# Altium schematic sheet obc-v2_CM4-IRQ-CTRL.SchDoc
size 420 x 297 mm; SheetNumber: 18; SheetTotal: 23
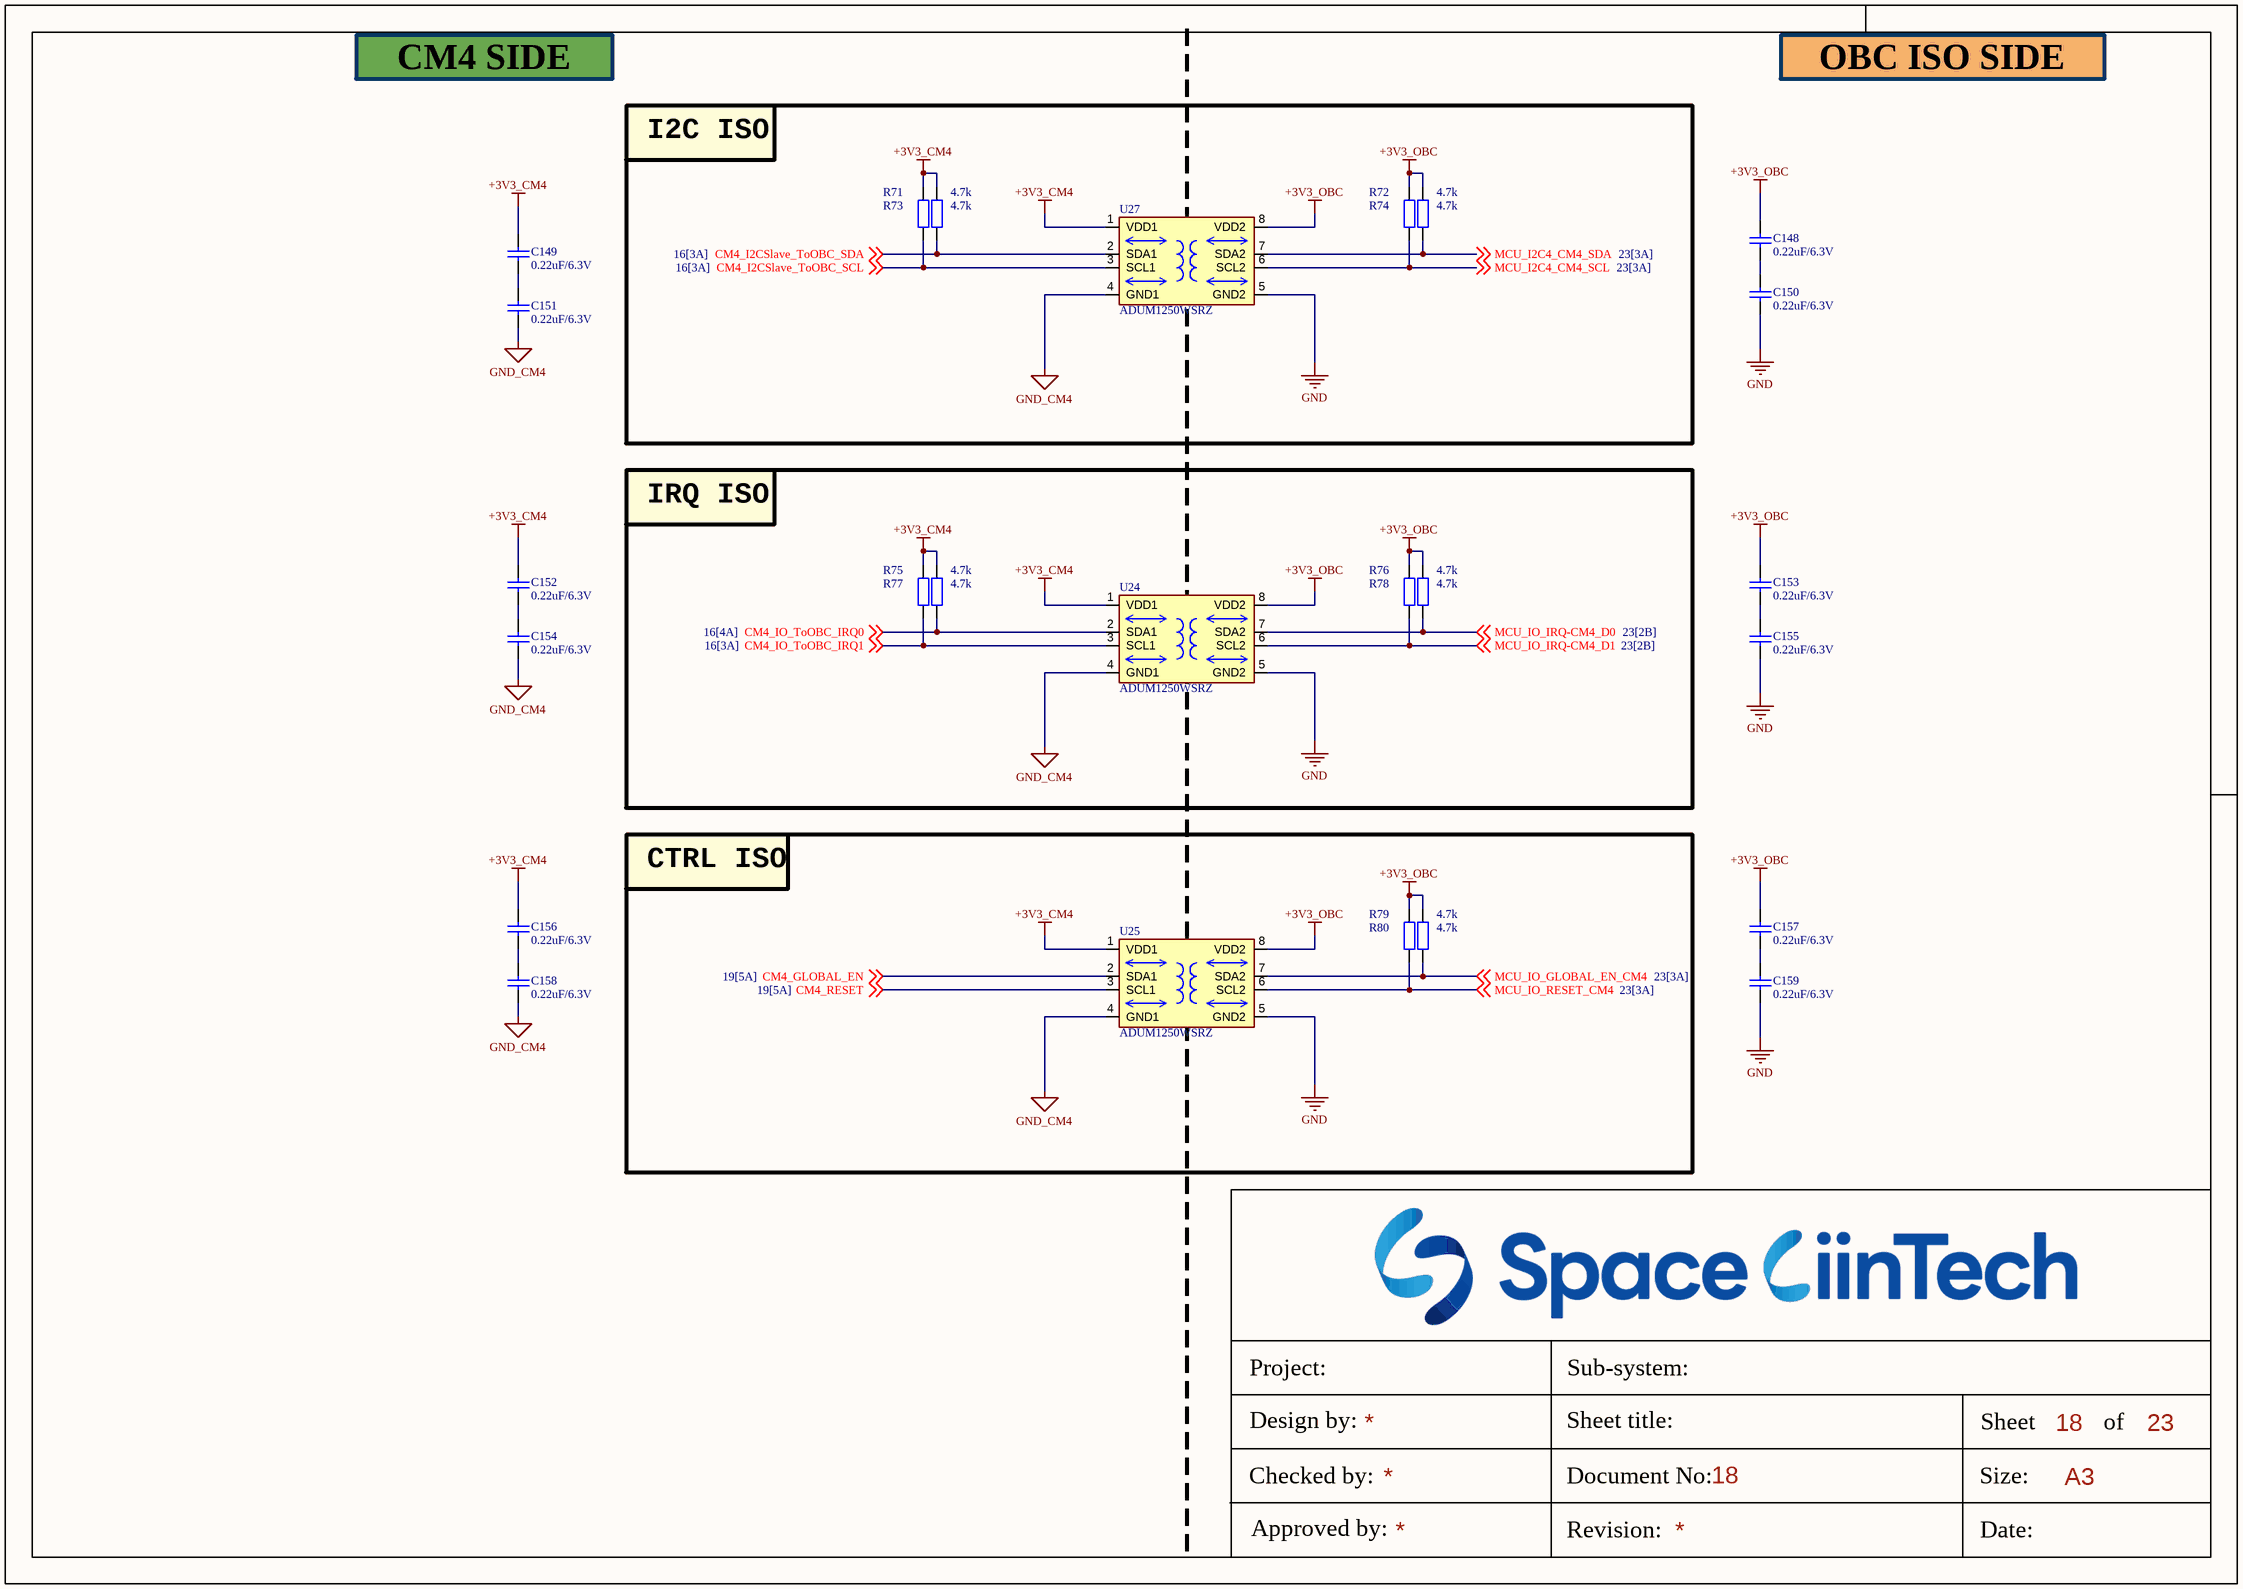
[diagram p0: obc-v2_CM4-IRQ-CTRL.SchDoc]

## Parts
C148  0.22uF/6.3V  [CAP_C_1005X60]
C149  0.22uF/6.3V  [CAP_C_1005X60]
C150  0.22uF/6.3V  [CAP_C_1005X60]
C151  0.22uF/6.3V  [CAP_C_1005X60]
C152  0.22uF/6.3V  [CAP_C_1005X60]
C153  0.22uF/6.3V  [CAP_C_1005X60]
C154  0.22uF/6.3V  [CAP_C_1005X60]
C155  0.22uF/6.3V  [CAP_C_1005X60]
C156  0.22uF/6.3V  [CAP_C_1005X60]
C157  0.22uF/6.3V  [CAP_C_1005X60]
C158  0.22uF/6.3V  [CAP_C_1005X60]
C159  0.22uF/6.3V  [CAP_C_1005X60]
R71  4.7k  [RES_C_1608X60]
R72  4.7k  [RES_C_1608X60]
R73  4.7k  [RES_C_1608X60]
R74  4.7k  [RES_C_1608X60]
R75  4.7k  [RES_C_1608X60]
R76  4.7k  [RES_C_1608X60]
R77  4.7k  [RES_C_1608X60]
R78  4.7k  [RES_C_1608X60]
R79  4.7k  [RES_C_1608X60]
R80  4.7k  [RES_C_1608X60]
U24  ADUM1250WSRZ  [SOIC127P602X173-8N]
U25  ADUM1250WSRZ  [SOIC127P602X173-8N]
U27  ADUM1250WSRZ  [SOIC127P602X173-8N]

## Blocks framed on the sheet
I2C ISO: R71-R74 U27
IRQ ISO: R75-R78 U24
CTRL ISO: R79 R80 U25

## Nets
+3V3_CM4: C149.1 C152.1 C156.1 R71.2 R73.2 R75.2 R77.2 U24.1(VDD1) U25.1(VDD1) U27.1(VDD1)
+3V3_OBC: C148.1 C153.1 C157.1 R72.2 R74.2 R76.2 R78.2 R79.2 R80.2 U24.8(VDD2) U25.8(VDD2) U27.8(VDD2)
GND: C150.2 C155.2 C159.2 U24.5(GND2) U25.5(GND2) U27.5(GND2)
GND_CM4: C151.2 C154.2 C158.2 U24.4(GND1) U25.4(GND1) U27.4(GND1)
CM4_GLOBAL_EN: U25.2(SDA1) ; off-sheet CM4_GLOBAL_EN
CM4_I2CSlave_ToOBC_SCL: R71.1 U27.3(SCL1) ; off-sheet CM4_I2CSlave_ToOBC_SCL
CM4_I2CSlave_ToOBC_SDA: R73.1 U27.2(SDA1) ; off-sheet CM4_I2CSlave_ToOBC_SDA
CM4_IO_ToOBC_IRQ0: R77.1 U24.2(SDA1) ; off-sheet CM4_IO_ToOBC_IRQ0
CM4_IO_ToOBC_IRQ1: R75.1 U24.3(SCL1) ; off-sheet CM4_IO_ToOBC_IRQ1
CM4_RESET: U25.3(SCL1) ; off-sheet CM4_RESET
MCU_I2C4_CM4_SCL: R72.1 U27.6(SCL2) ; off-sheet MCU_I2C4_CM4_SCL
MCU_I2C4_CM4_SDA: R74.1 U27.7(SDA2) ; off-sheet MCU_I2C4_CM4_SDA
MCU_IO_GLOBAL_EN_CM4: R80.1 U25.7(SDA2) ; off-sheet MCU_IO_GLOBAL_EN_CM4
MCU_IO_IRQ-CM4_D0: R78.1 U24.7(SDA2) ; off-sheet MCU_IO_IRQ-CM4_D0
MCU_IO_IRQ-CM4_D1: R76.1 U24.6(SCL2) ; off-sheet MCU_IO_IRQ-CM4_D1
MCU_IO_RESET_CM4: R79.1 U25.6(SCL2) ; off-sheet MCU_IO_RESET_CM4
NetC148_2: C148.2 C150.1
NetC149_2: C149.2 C151.1
NetC152_2: C152.2 C154.1
NetC153_2: C153.2 C155.1
NetC156_2: C156.2 C158.1
NetC157_2: C157.2 C159.1

## Notes on the sheet
- CM4 SIDE
- OBC ISO SIDE
- Project:
- Sub-system:
- Design by:
- Sheet title:
- Sheet
- A3
- of
- Checked by:
- Approved by:
- Revision:
- Document No:
- Size:
- Date:

## Library data of the parts
C148-C159 = Tu 0402 33nF 10V: CAPC; Chung_Loai: Dán; Don_Vi: Con; So_Chan: 2; Ten_Linh_Kien: Tụ 0402 33nF X7R 10V GRM155R71A333KA01D; Ma_Hang: MH007853; Kieu_Chan: *
R71-R80 = Tro 0603 1% 10k: RES; Chung_Loai: Dán; Don_Vi: Con; So_Chan: 2; Ten_Linh_Kien: Trở 0603 1% 10k; Ma_Hang: MH006333; Kieu_Chan: *
U24 U25 U27 = ADUM1250: IÂ²C Digital Isolator 2500Vrms 2 Channel 1Mbps 25kV/Âµs CMTI 8-SOIC (0.154", 3.90mm Width); MF: Analog Devices; Package: SOIC-8; Price: None; Value: *; SnapEDA_Link: https://www.snapeda.com/parts/ADUM1250/Analog+Devices/view-part/?ref=snap; MP: ADUM1250; Availability: Unavailable; Check_prices: https://www.snapeda.com/parts/ADUM1250/Analog+Devices/view-part/?ref=eda